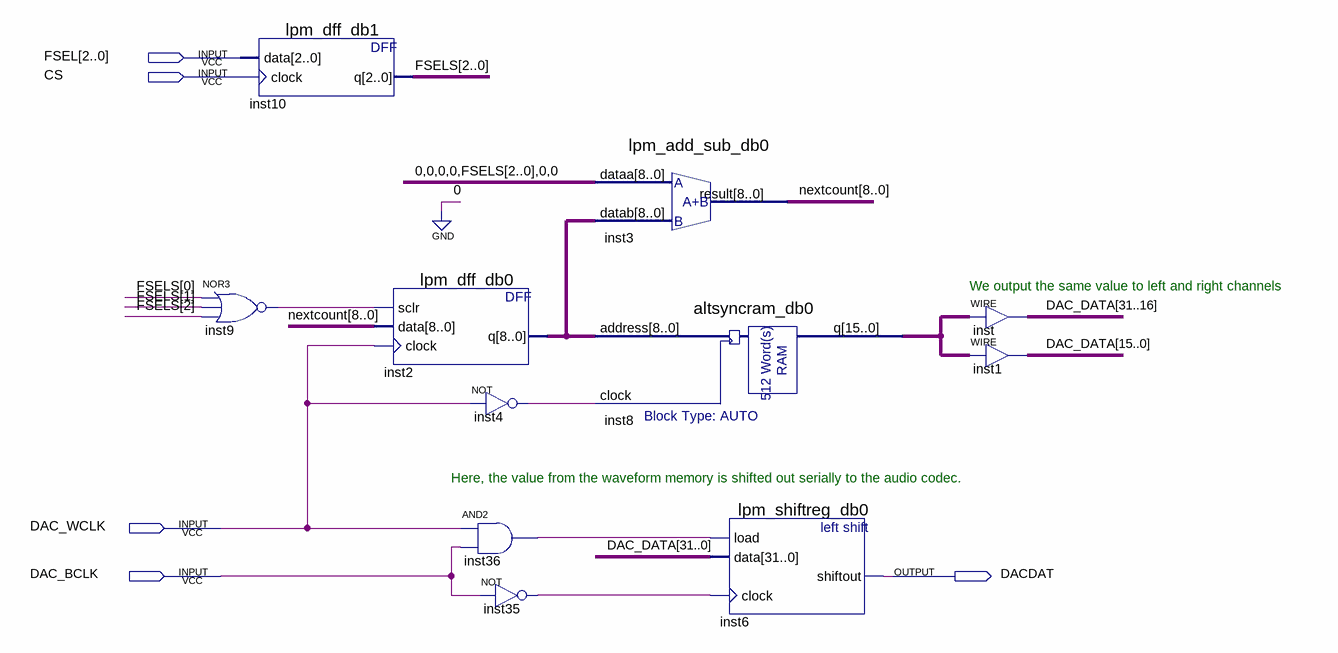
[diagram p0: schematic sheet]
// Quartus schematic DAC_BEEP.bdf as structural Verilog: 11 symbols, 5 pins
module DAC_BEEP (
  input  [2:0] FSEL,
  input  CS,
  input  DAC_WCLK,
  input  DAC_BCLK,
  output DACDAT
);

  wire inst4_out, inst9_out, inst35_out, inst36_out;
  wire [2:0] FSELS;
  wire [8:0] inst2_q, nextcount;
  wire [15:0] inst8_q;
  wire [31:0] DAC_DATA;

  lpm_dff_db1 inst10 (.data(FSEL), .clock(CS), .q(FSELS));
  nor inst9 (inst9_out, FSELS[0], FSELS[1], FSELS[2]);
  lpm_dff_db0 inst2 (.sclr(inst9_out), .data(nextcount), .clock(DAC_WCLK), .q(inst2_q));
  not inst4 (inst4_out, DAC_WCLK);
  and inst36 (inst36_out, DAC_WCLK, DAC_BCLK);
  not inst35 (inst35_out, DAC_BCLK);
  lpm_add_sub_db0 inst3 (.dataa({4'b0000, FSELS, 2'b00}), .datab(inst2_q), .result(nextcount));
  altsyncram_db0 inst8 (.address(inst2_q), .clock(inst4_out), .q(inst8_q));
  lpm_shiftreg_db0 inst6 (.load(inst36_out), .data(DAC_DATA), .clock(inst35_out), .shiftout(DACDAT));
  assign DAC_DATA[31:16] = inst8_q;  // WIRE inst
  assign DAC_DATA[15:0] = inst8_q;  // WIRE inst1

  // Notes on the sheet:
  //   We output the same value to left and right channels
  //   Here, the value from the waveform memory is shifted out serially to the audio codec.
endmodule
